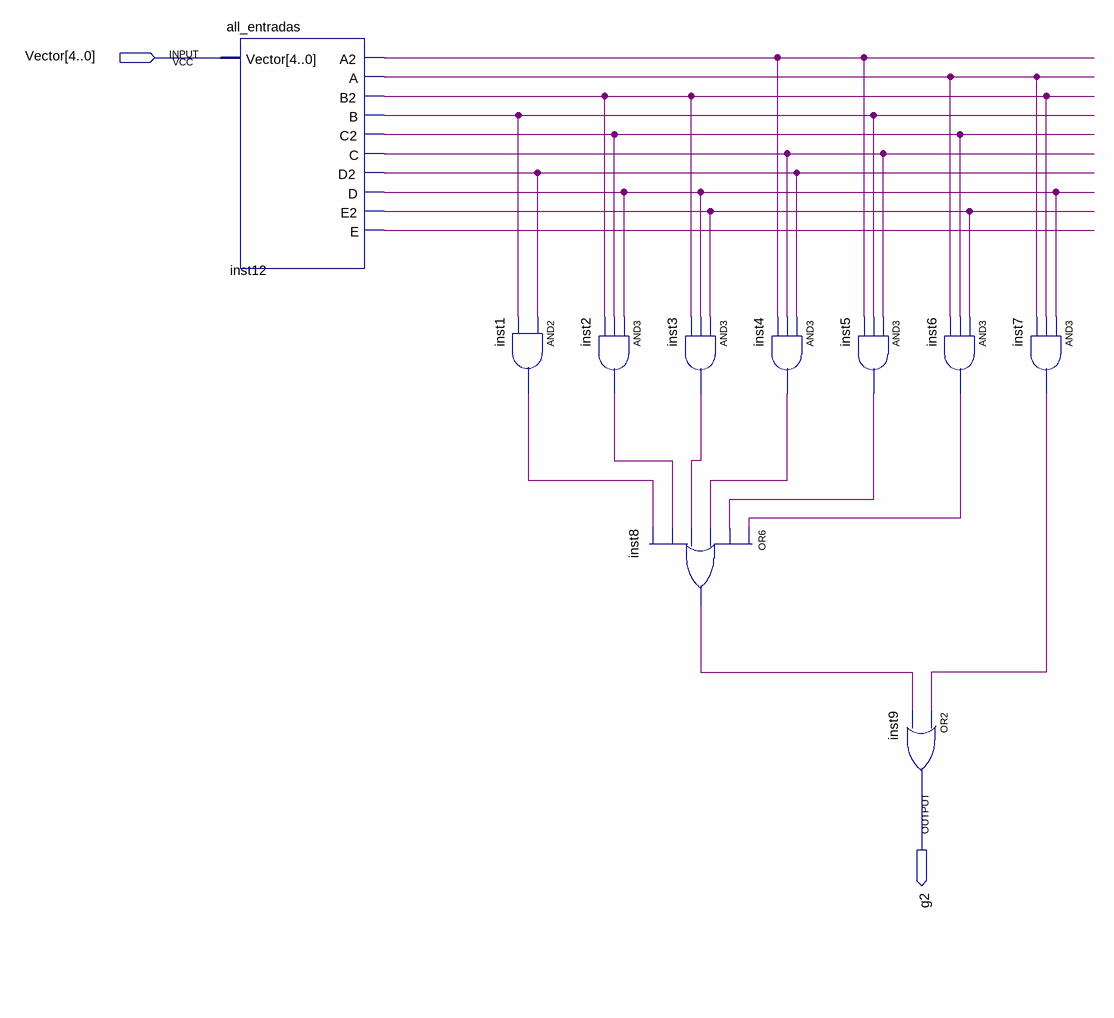
[diagram p0: schematic sheet]
// Quartus schematic g2.bdf as structural Verilog: 10 symbols, 2 pins
module g2 (
  input  [4:0] Vector,
  output g2
);

  wire inst1_out, inst2_out, inst3_out, inst4_out, inst5_out, inst6_out, inst7_out, inst8_out, inst12_a,
       inst12_a2, inst12_b, inst12_b2, inst12_c, inst12_c2, inst12_d, inst12_d2, inst12_e, inst12_e2;

  all_entradas inst12 (
    .Vector(Vector), .A2(inst12_a2), .A(inst12_a), .B2(inst12_b2), .B(inst12_b), .C2(inst12_c2),
    .C(inst12_c), .D2(inst12_d2), .D(inst12_d), .E2(inst12_e2), .E(inst12_e));
  and inst1 (inst1_out, inst12_d2, inst12_b);
  and inst2 (inst2_out, inst12_d, inst12_c2, inst12_b2);
  or inst8 (inst8_out, inst6_out, inst5_out, inst4_out, inst3_out, inst2_out, inst1_out);
  and inst3 (inst3_out, inst12_e2, inst12_d, inst12_b2);
  and inst4 (inst4_out, inst12_d2, inst12_c, inst12_a2);
  and inst5 (inst5_out, inst12_c, inst12_b, inst12_a2);
  and inst6 (inst6_out, inst12_e2, inst12_c2, inst12_a);
  or inst9 (g2, inst7_out, inst8_out);
  and inst7 (inst7_out, inst12_d, inst12_b2, inst12_a);
endmodule
